# Altium schematic sheet PIC24Filter.SchDoc
size B
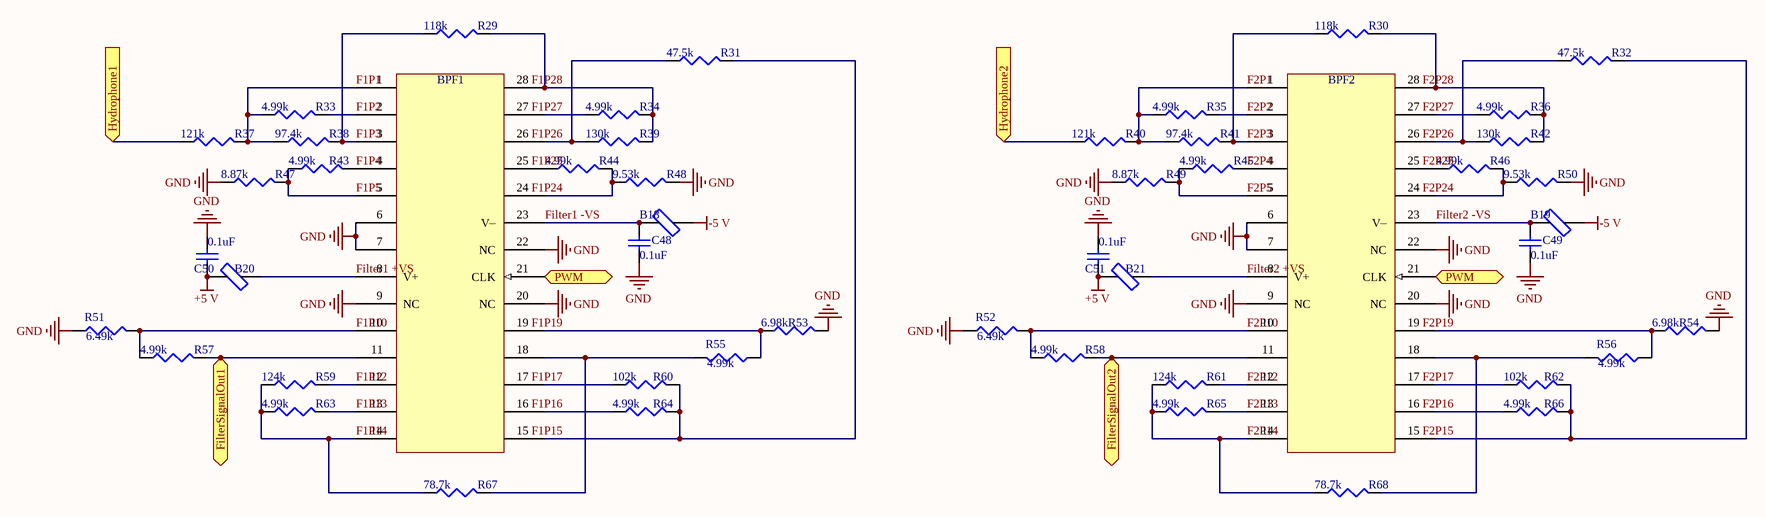
[diagram p0: PIC24Filter.SchDoc]

## Parts
B18  Ferrite Bead  [Resistor 0603]  (value not drawn)
B19  Ferrite Bead  [Resistor 0603]  (value not drawn)
B20  Ferrite Bead  [Resistor 0603]  (value not drawn)
B21  Ferrite Bead  [Resistor 0603]  (value not drawn)
BPF1  LTC1068-25IG SSOP-28  [SSOP-28]  (value not drawn)
BPF2  LTC1068-25IG SSOP-28  [SSOP-28]  (value not drawn)
C48  value 0.1uF  [C1206]  (hidden comment: .1uF 20V Ceramic Low ESR)
C49  value 0.1uF  [C1206]  (hidden comment: .1uF 20V Ceramic Low ESR)
C50  value 0.1uF  [C1206]  (hidden comment: .1uF 20V Ceramic Low ESR)
C51  value 0.1uF  [C1206]  (hidden comment: .1uF 20V Ceramic Low ESR)
R29  value 118k  [Capacitor 0603]  (hidden comment: 1/16 118K watt 1%)
R30  value 118k  [Capacitor 0603]  (hidden comment: 1/16 118K watt 1%)
R31  value 47.5k  [Capacitor 0603]  (hidden comment: 1/16 47.5K watt 1%)
R32  value 47.5k  [Capacitor 0603]  (hidden comment: 1/16 47.5K watt 1%)
R33  value 4.99k  [Capacitor 0603]  (hidden comment: 1/16 4.99K watt 1%)
R34  value 4.99k  [Capacitor 0603]  (hidden comment: 1/16 4.99K watt 1%)
R35  value 4.99k  [Capacitor 0603]  (hidden comment: 1/16 4.99K watt 1%)
R36  value 4.99k  [Capacitor 0603]  (hidden comment: 1/16 4.99K watt 1%)
R37  value 121k  [Capacitor 0603]  (hidden comment: 1/16 121K watt 1%)
R38  value 97.4k  [Capacitor 0603]  (hidden comment: 1/16 97.4K watt 1%)
R39  value 130k  [Capacitor 0603]  (hidden comment: 1/16 130K watt 1%)
R40  value 121k  [Capacitor 0603]  (hidden comment: 1/16 121K watt 1%)
R41  value 97.4k  [Capacitor 0603]  (hidden comment: 1/16 97.4K watt 1%)
R42  value 130k  [Capacitor 0603]  (hidden comment: 1/16 130K watt 1%)
R43  value 4.99k  [Capacitor 0603]  (hidden comment: 1/16 4.99K watt 1%)
R44  value 4.99k  [Capacitor 0603]  (hidden comment: 1/16 4.99K watt 1%)
R45  value 4.99k  [Capacitor 0603]  (hidden comment: 1/16 4.99K watt 1%)
R46  value 4.99k  [Capacitor 0603]  (hidden comment: 1/16 4.99K watt 1%)
R47  value 8.87k  [Capacitor 0603]  (hidden comment: 1/16 8.87K watt 1%)
R48  value 9.53k  [Capacitor 0603]  (hidden comment: 1/16 9.53K watt 1%)
R49  value 8.87k  [Capacitor 0603]  (hidden comment: 1/16 8.87K watt 1%)
R50  value 9.53k  [Capacitor 0603]  (hidden comment: 1/16 9.53K watt 1%)
R51  value 6.49k  [Capacitor 0603]  (hidden comment: 1/16 6.49K watt 1%)
R52  value 6.49k  [Capacitor 0603]  (hidden comment: 1/16 6.49K watt 1%)
R53  value 6.98k  [Capacitor 0603]  (hidden comment: 1/16 6.98K watt 1%)
R54  value 6.98k  [Capacitor 0603]  (hidden comment: 1/16 6.98K watt 1%)
R55  value 4.99k  [Capacitor 0603]  (hidden comment: 1/16 4.99K watt 1%)
R56  value 4.99k  [Capacitor 0603]  (hidden comment: 1/16 4.99K watt 1%)
R57  value 4.99k  [Capacitor 0603]  (hidden comment: 1/16 4.99K watt 1%)
R58  value 4.99k  [Capacitor 0603]  (hidden comment: 1/16 4.99K watt 1%)
R59  value 124k  [Capacitor 0603]  (hidden comment: 1/16 124K watt 1%)
R60  value 102k  [Capacitor 0603]  (hidden comment: 1/16 102K watt 1%)
R61  value 124k  [Capacitor 0603]  (hidden comment: 1/16 124K watt 1%)
R62  value 102k  [Capacitor 0603]  (hidden comment: 1/16 102K watt 1%)
R63  value 4.99k  [Capacitor 0603]  (hidden comment: 1/16 4.99K watt 1%)
R64  value 4.99k  [Capacitor 0603]  (hidden comment: 1/16 4.99K watt 1%)
R65  value 4.99k  [Capacitor 0603]  (hidden comment: 1/16 4.99K watt 1%)
R66  value 4.99k  [Capacitor 0603]  (hidden comment: 1/16 4.99K watt 1%)
R67  value 78.7k  [Capacitor 0603]  (hidden comment: 1/16 78.7K watt 1%)
R68  value 78.7k  [Capacitor 0603]  (hidden comment: 1/16 78.7K watt 1%)

## Ports
FilterSignalOut1 (out), FilterSignalOut2 (out), Hydrophone1 (in), Hydrophone2 (in), PWM (in)

## Nets
+5 V: B20.1 B21.1 C50.1 C51.1
-5 V: B18.2 B19.2
GND: BPF1.6(NC) BPF1.7(AGND) BPF1.9(NC) BPF1.20(NC) BPF1.22(NC) BPF2.6(NC) BPF2.7(AGND) BPF2.9(NC) BPF2.20(NC) BPF2.22(NC) C48.2 C49.2 C50.2 C51.2 R47.1 R48.2 R49.1 R50.2 R51.1 R52.1 R53.2 R54.2
F1P1: BPF1.1(INV_B) R33.1 R37.2 R38.1
F1P2: BPF1.2(HPB/NB) R33.2
F1P3: BPF1.3(BPB) R29.1 R38.2
F1P4: BPF1.4(LPB) R43.2
F1P5: BPF1.5(SB) R43.1 R47.2
F1P10: BPF1.10(SA) R51.2 R57.1
F1P12: BPF1.12(BPA) R59.2
F1P13: BPF1.13(HPA/NA) R63.2
F1P14: BPF1.14(INV_A) R59.1 R63.1 R67.1
F2P1: BPF2.1(INV_B) R35.1 R40.2 R41.1
F2P2: BPF2.2(HPB/NB) R35.2
F2P3: BPF2.3(BPB) R30.1 R41.2
F2P4: BPF2.4(LPB) R45.2
F2P5: BPF2.5(SB) R45.1 R49.2
F2P10: BPF2.10(SA) R52.2 R58.1
F2P12: BPF2.12(BPA) R61.2
F2P13: BPF2.13(HPA/NA) R65.2
F2P14: BPF2.14(INV_A) R61.1 R65.1 R68.1
Filter1 +VS: B20.2 BPF1.8(V+)
Filter1 -VS: B18.1 BPF1.23(V–) C48.1
Filter2 +VS: B21.2 BPF2.8(V+)
Filter2 -VS: B19.1 BPF2.23(V–) C49.1
FilterSignalOut1: BPF1.11(LPA) R57.2 ; port FilterSignalOut1
FilterSignalOut2: BPF2.11(LPA) R58.2 ; port FilterSignalOut2
Hydrophone1: R37.1 ; port Hydrophone1
Hydrophone2: R40.1 ; port Hydrophone2
PWM: BPF1.21(CLK) BPF2.21(CLK) ; port PWM
NetBPF1_15: BPF1.15(INV_D) R31.2 R60.2 R64.2
NetBPF1_16: BPF1.16(HPD/ND) R64.1
NetBPF1_17: BPF1.17(BPD) R60.1
NetBPF1_18: BPF1.18(LPD) R55.2 R67.2
NetBPF1_19: BPF1.19(SD) R53.1 R55.1
NetBPF1_24: BPF1.24(SC) R44.2 R48.1
NetBPF1_25: BPF1.25(LPC) R44.1
NetBPF1_26: BPF1.26(BPC) R31.1 R39.1
NetBPF1_27: BPF1.27(HPC/NC) R34.1
NetBPF1_28: BPF1.28(INV_C) R29.2 R34.2 R39.2
NetBPF2_15: BPF2.15(INV_D) R32.2 R62.2 R66.2
NetBPF2_16: BPF2.16(HPD/ND) R66.1
NetBPF2_17: BPF2.17(BPD) R62.1
NetBPF2_18: BPF2.18(LPD) R56.2 R68.2
NetBPF2_19: BPF2.19(SD) R54.1 R56.1
NetBPF2_24: BPF2.24(SC) R46.2 R50.1
NetBPF2_25: BPF2.25(LPC) R46.1
NetBPF2_26: BPF2.26(BPC) R32.1 R42.1
NetBPF2_27: BPF2.27(HPC/NC) R36.1
NetBPF2_28: BPF2.28(INV_C) R30.2 R36.2 R42.2

## Notes on the sheet
- Labels drawn without touching a wire or pin: F1P15, F1P16, F1P17, F1P19, F1P24, F1P25, F1P26, F1P27, F1P28, F2P15, F2P16, F2P17, F2P19, F2P24, F2P25, F2P26, F2P27, F2P28

## Library data of the parts
B18-B21 = Ferrite Bead: Ferrite Bead: 200 Ohm @ 25 Mhz
BPF1 BPF2 = LTC1068
C48-C51 = Cap Semi: Capacitor (Semiconductor SIM Model); Published: 8-Jun-2000; LatestRevisionDate: 29-May-2009; LatestRevisionNote: IPC-7351 Footprint Added.; PackageReference: C1206; Publisher: Altium Limited; PackageDescription: Chip Capacitor
R29-R68 = Res3: Resistor; Published: 8-Jun-2000; LatestRevisionDate: 29-May-2009; LatestRevisionNote: IPC-7351 Footprint Added.; PackageReference: J1-0603; Publisher: Altium Limited; PackageDescription: Chip Resistor